# Altium schematic sheet TopAmplifier.SchDoc
size 215 x 228 mm; PageSetup: Record=PageOptions|CenterHorizontal=True|CenterVertical=True|PrintScale=0.97|XCorrection=1.00|YCorrection=1.00|PrintKind=1|BorderSize=5000000|LeftOffset=0|BottomOffset=0|Orientation=2|PaperLength=1270|PaperWidth=1000|Scale=100|PaperSource=4|PrintQuality=600|MediaType=1|DitherType=10|PaperKind=A4|PrintScaleMode=1
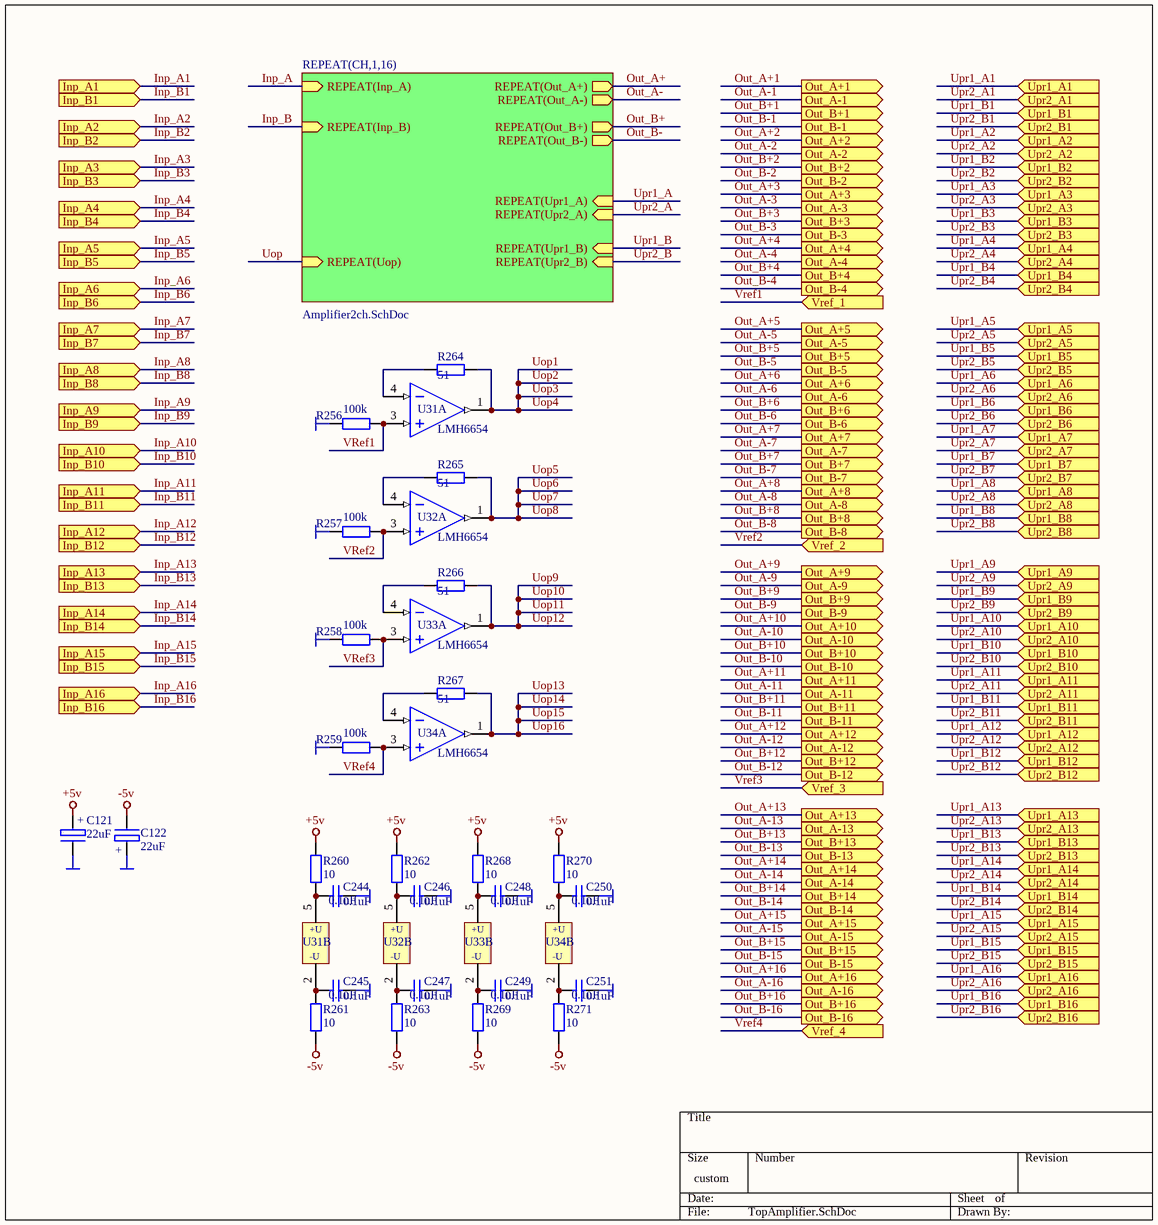
[diagram p0: TopAmplifier.SchDoc]

## Parts
C121  22uF  [CP6032]
C122  22uF  [CP6032]
C244  0.1uF  [0402]
C245  0.1uF  [0402]
C246  0.1uF  [0402]
C247  0.1uF  [0402]
C248  0.1uF  [0402]
C249  0.1uF  [0402]
C250  0.1uF  [0402]
C251  0.1uF  [0402]
R256  100k  [0603]
R257  100k  [0603]
R258  100k  [0603]
R259  100k  [0603]
R260  10  [0603]
R261  10  [0603]
R262  10  [0603]
R263  10  [0603]
R264  51  [0603]
R265  51  [0603]
R266  51  [0603]
R267  51  [0603]
R268  10  [0603]
R269  10  [0603]
R270  10  [0603]
R271  10  [0603]
U31  LMH6654  [SOT-23-5]  (parts A,B of 2)
U32  LMH6654  [SOT-23-5]  (parts A,B of 2)
U33  LMH6654  [SOT-23-5]  (parts A,B of 2)
U34  LMH6654  [SOT-23-5]  (parts A,B of 2)

## Sub-sheets
REPEAT(CH,1,16) = Amplifier2ch.SchDoc: REPEAT(Inp_A) (in), REPEAT(Out_A-) (out), REPEAT(Out_A+) (out), REPEAT(Out_B-) (out), REPEAT(Out_B+) (out), REPEAT(Inp_B) (in), REPEAT(Uop) (in), REPEAT(Upr1_A) (in), REPEAT(Upr2_A) (in), REPEAT(Upr1_B) (in), REPEAT(Upr2_B) (in)

## Ports
Inp_A1 (in), Inp_A2 (in), Inp_A3 (in), Inp_A4 (in), Inp_A5 (in), Inp_A6 (in), Inp_A7 (in), Inp_A8 (in), Inp_A9 (in), Inp_A10 (in), Inp_A11 (in), Inp_A12 (in), Inp_A13 (in), Inp_A14 (in), Inp_A15 (in), Inp_A16 (in), Inp_B1 (in), Inp_B2 (in), Inp_B3 (in), Inp_B4 (in), Inp_B5 (in), Inp_B6 (in), Inp_B7 (in), Inp_B8 (in), Inp_B9 (in), Inp_B10 (in), Inp_B11 (in), Inp_B12 (in), Inp_B13 (in), Inp_B14 (in), Inp_B15 (in), Inp_B16 (in), Out_A+1 (out), Out_A+2 (out), Out_A+3 (out), Out_A+4 (out), Out_A+5 (out), Out_A+6 (out), Out_A+7 (out), Out_A+8 (out), Out_A+9 (out), Out_A+10 (out), Out_A+11 (out), Out_A+12 (out), Out_A+13 (out), Out_A+14 (out), Out_A+15 (out), Out_A+16 (out), Out_A-1 (out), Out_A-2 (out), Out_A-3 (out), Out_A-4 (out), Out_A-5 (out), Out_A-6 (out), Out_A-7 (out), Out_A-8 (out), Out_A-9 (out), Out_A-10 (out), Out_A-11 (out), Out_A-12 (out), Out_A-13 (out), Out_A-14 (out), Out_A-15 (out), Out_A-16 (out), Out_B+1 (out), Out_B+2 (out), Out_B+3 (out), Out_B+4 (out), Out_B+5 (out), Out_B+6 (out), Out_B+7 (out), Out_B+8 (out), Out_B+9 (out), Out_B+10 (out), Out_B+11 (out), Out_B+12 (out), Out_B+13 (out), Out_B+14 (out), Out_B+15 (out), Out_B+16 (out), Out_B-1 (out), Out_B-2 (out), Out_B-3 (out), Out_B-4 (out), Out_B-5 (out), Out_B-6 (out), Out_B-7 (out), Out_B-8 (out), Out_B-9 (out), Out_B-10 (out), Out_B-11 (out), Out_B-12 (out), Out_B-13 (out), Out_B-14 (out), Out_B-15 (out), Out_B-16 (out), Upr1_A1 (in), Upr1_A2 (in), Upr1_A3 (in), Upr1_A4 (in), Upr1_A5 (in), Upr1_A6 (in), Upr1_A7 (in), Upr1_A8 (in), Upr1_A9 (in), Upr1_A10 (in), Upr1_A11 (in), Upr1_A12 (in), Upr1_A13 (in), Upr1_A14 (in), Upr1_A15 (in), Upr1_A16 (in), Upr1_B1 (in), Upr1_B2 (in), Upr1_B3 (in), Upr1_B4 (in), Upr1_B5 (in), Upr1_B6 (in), Upr1_B7 (in), Upr1_B8 (in), Upr1_B9 (in), Upr1_B10 (in), Upr1_B11 (in), Upr1_B12 (in), Upr1_B13 (in), Upr1_B14 (in), Upr1_B15 (in), Upr1_B16 (in), Upr2_A1 (in), Upr2_A2 (in), Upr2_A3 (in), Upr2_A4 (in), Upr2_A5 (in), Upr2_A6 (in), Upr2_A7 (in), Upr2_A8 (in), Upr2_A9 (in), Upr2_A10 (in), Upr2_A11 (in), Upr2_A12 (in), Upr2_A13 (in), Upr2_A14 (in), Upr2_A15 (in), Upr2_A16 (in), Upr2_B1 (in), Upr2_B2 (in), Upr2_B3 (in), Upr2_B4 (in), Upr2_B5 (in), Upr2_B6 (in), Upr2_B7 (in), Upr2_B8 (in), Upr2_B9 (in), Upr2_B10 (in), Upr2_B11 (in), Upr2_B12 (in), Upr2_B13 (in), Upr2_B14 (in), Upr2_B15 (in), Upr2_B16 (in), Vref_1 (in), Vref_2 (in), Vref_3 (in), Vref_4 (in)

## Nets
+5v: C121.+ R260.2 R262.2 R268.2 R270.2
-5v: C122.- R261.1 R263.1 R269.1 R271.1
AGND: C121.- C122.+ R256.1 R257.1 R258.1 R259.1
GND: C244.1 C245.1 C246.1 C247.1 C248.1 C249.1 C250.1 C251.1
Inp_A: sheet REPEAT(CH,1,16)/REPEAT(Inp_A)
Inp_A1: port Inp_A1
Inp_A2: port Inp_A2
Inp_A3: port Inp_A3
Inp_A4: port Inp_A4
Inp_A5: port Inp_A5
Inp_A6: port Inp_A6
Inp_A7: port Inp_A7
Inp_A8: port Inp_A8
Inp_A9: port Inp_A9
Inp_A10: port Inp_A10
Inp_A11: port Inp_A11
Inp_A12: port Inp_A12
Inp_A13: port Inp_A13
Inp_A14: port Inp_A14
Inp_A15: port Inp_A15
Inp_A16: port Inp_A16
Inp_B: sheet REPEAT(CH,1,16)/REPEAT(Inp_B)
Inp_B1: port Inp_B1
Inp_B2: port Inp_B2
Inp_B3: port Inp_B3
Inp_B4: port Inp_B4
Inp_B5: port Inp_B5
Inp_B6: port Inp_B6
Inp_B7: port Inp_B7
Inp_B8: port Inp_B8
Inp_B9: port Inp_B9
Inp_B10: port Inp_B10
Inp_B11: port Inp_B11
Inp_B12: port Inp_B12
Inp_B13: port Inp_B13
Inp_B14: port Inp_B14
Inp_B15: port Inp_B15
Inp_B16: port Inp_B16
Out_A+: sheet REPEAT(CH,1,16)/REPEAT(Out_A+)
Out_A+1: port Out_A+1
Out_A+2: port Out_A+2
Out_A+3: port Out_A+3
Out_A+4: port Out_A+4
Out_A+5: port Out_A+5
Out_A+6: port Out_A+6
Out_A+7: port Out_A+7
Out_A+8: port Out_A+8
Out_A+9: port Out_A+9
Out_A+10: port Out_A+10
Out_A+11: port Out_A+11
Out_A+12: port Out_A+12
Out_A+13: port Out_A+13
Out_A+14: port Out_A+14
Out_A+15: port Out_A+15
Out_A+16: port Out_A+16
Out_A-: sheet REPEAT(CH,1,16)/REPEAT(Out_A-)
Out_A-1: port Out_A-1
Out_A-2: port Out_A-2
Out_A-3: port Out_A-3
Out_A-4: port Out_A-4
Out_A-5: port Out_A-5
Out_A-6: port Out_A-6
Out_A-7: port Out_A-7
Out_A-8: port Out_A-8
Out_A-9: port Out_A-9
Out_A-10: port Out_A-10
Out_A-11: port Out_A-11
Out_A-12: port Out_A-12
Out_A-13: port Out_A-13
Out_A-14: port Out_A-14
Out_A-15: port Out_A-15
Out_A-16: port Out_A-16
Out_B+: sheet REPEAT(CH,1,16)/REPEAT(Out_B+)
Out_B+1: port Out_B+1
Out_B+2: port Out_B+2
Out_B+3: port Out_B+3
Out_B+4: port Out_B+4
Out_B+5: port Out_B+5
Out_B+6: port Out_B+6
Out_B+7: port Out_B+7
Out_B+8: port Out_B+8
Out_B+9: port Out_B+9
Out_B+10: port Out_B+10
Out_B+11: port Out_B+11
Out_B+12: port Out_B+12
Out_B+13: port Out_B+13
Out_B+14: port Out_B+14
Out_B+15: port Out_B+15
Out_B+16: port Out_B+16
Out_B-: sheet REPEAT(CH,1,16)/REPEAT(Out_B-)
Out_B-1: port Out_B-1
Out_B-2: port Out_B-2
Out_B-3: port Out_B-3
Out_B-4: port Out_B-4
Out_B-5: port Out_B-5
Out_B-6: port Out_B-6
Out_B-7: port Out_B-7
Out_B-8: port Out_B-8
Out_B-9: port Out_B-9
Out_B-10: port Out_B-10
Out_B-11: port Out_B-11
Out_B-12: port Out_B-12
Out_B-13: port Out_B-13
Out_B-14: port Out_B-14
Out_B-15: port Out_B-15
Out_B-16: port Out_B-16
Uop: sheet REPEAT(CH,1,16)/REPEAT(Uop)
Uop1: R264.2 U31.1(OUT)  [also labelled Uop2, Uop3, Uop4]
Uop5: R265.2 U32.1(OUT)  [also labelled Uop6, Uop7, Uop8]
Uop10: R266.2 U33.1(OUT)  [also labelled Uop11, Uop12, Uop9]
Uop13: R267.2 U34.1(OUT)  [also labelled Uop14, Uop15, Uop16]
Upr1_A: sheet REPEAT(CH,1,16)/REPEAT(Upr1_A)
Upr1_A1: port Upr1_A1
Upr1_A2: port Upr1_A2
Upr1_A3: port Upr1_A3
Upr1_A4: port Upr1_A4
Upr1_A5: port Upr1_A5
Upr1_A6: port Upr1_A6
Upr1_A7: port Upr1_A7
Upr1_A8: port Upr1_A8
Upr1_A9: port Upr1_A9
Upr1_A10: port Upr1_A10
Upr1_A11: port Upr1_A11
Upr1_A12: port Upr1_A12
Upr1_A13: port Upr1_A13
Upr1_A14: port Upr1_A14
Upr1_A15: port Upr1_A15
Upr1_A16: port Upr1_A16
Upr1_B: sheet REPEAT(CH,1,16)/REPEAT(Upr1_B)
Upr1_B1: port Upr1_B1
Upr1_B2: port Upr1_B2
Upr1_B3: port Upr1_B3
Upr1_B4: port Upr1_B4
Upr1_B5: port Upr1_B5
Upr1_B6: port Upr1_B6
Upr1_B7: port Upr1_B7
Upr1_B8: port Upr1_B8
Upr1_B9: port Upr1_B9
Upr1_B10: port Upr1_B10
Upr1_B11: port Upr1_B11
Upr1_B12: port Upr1_B12
Upr1_B13: port Upr1_B13
Upr1_B14: port Upr1_B14
Upr1_B15: port Upr1_B15
Upr1_B16: port Upr1_B16
Upr2_A: sheet REPEAT(CH,1,16)/REPEAT(Upr2_A)
Upr2_A1: port Upr2_A1
Upr2_A2: port Upr2_A2
Upr2_A3: port Upr2_A3
Upr2_A4: port Upr2_A4
Upr2_A5: port Upr2_A5
Upr2_A6: port Upr2_A6
Upr2_A7: port Upr2_A7
Upr2_A8: port Upr2_A8
Upr2_A9: port Upr2_A9
Upr2_A10: port Upr2_A10
Upr2_A11: port Upr2_A11
Upr2_A12: port Upr2_A12
Upr2_A13: port Upr2_A13
Upr2_A14: port Upr2_A14
Upr2_A15: port Upr2_A15
Upr2_A16: port Upr2_A16
Upr2_B: sheet REPEAT(CH,1,16)/REPEAT(Upr2_B)
Upr2_B1: port Upr2_B1
Upr2_B2: port Upr2_B2
Upr2_B3: port Upr2_B3
Upr2_B4: port Upr2_B4
Upr2_B5: port Upr2_B5
Upr2_B6: port Upr2_B6
Upr2_B7: port Upr2_B7
Upr2_B8: port Upr2_B8
Upr2_B9: port Upr2_B9
Upr2_B10: port Upr2_B10
Upr2_B11: port Upr2_B11
Upr2_B12: port Upr2_B12
Upr2_B13: port Upr2_B13
Upr2_B14: port Upr2_B14
Upr2_B15: port Upr2_B15
Upr2_B16: port Upr2_B16
Vref1: R256.2 U31.3(IN+) ; port Vref_1
Vref2: R257.2 U32.3(IN+) ; port Vref_2
Vref3: R258.2 U33.3(IN+) ; port Vref_3
Vref4: R259.2 U34.3(IN+) ; port Vref_4
NetC244_2: C244.2 R260.1 U31.5(VDD)
NetC245_2: C245.2 R261.2 U31.2(GND)
NetC246_2: C246.2 R262.1 U32.5(VDD)
NetC247_2: C247.2 R263.2 U32.2(GND)
NetC248_2: C248.2 R268.1 U33.5(VDD)
NetC249_2: C249.2 R269.2 U33.2(GND)
NetC250_2: C250.2 R270.1 U34.5(VDD)
NetC251_2: C251.2 R271.2 U34.2(GND)
NetR264_1: R264.1 U31.4(IN-)
NetR265_1: R265.1 U32.4(IN-)
NetR266_1: R266.1 U33.4(IN-)
NetR267_1: R267.1 U34.4(IN-)

## Notes on the sheet
- (in symbol LMH6654, part B) +U; -U

## Library data of the parts
C121 C122 = C POL
C244-C251 = Cap: Capacitor; Published: 8-Jun-2000; LatestRevisionDate: 17-Jul-2002; LatestRevisionNote: Re-released for DXP Platform.; PackageReference: RAD-0.3; Publisher: Altium Limited; Value: 0.1uF
R256-R271 = Res2: Resistor; Published: 8-Jun-2000; LatestRevisionDate: 17-Jul-2002; LatestRevisionNote: Re-released for DXP Platform.; PackageReference: AXIAL-0.4; Publisher: Altium Limited
  R256-R259: Value: 100k
  R260-R263 R268-R271: Value: 10
  R264-R267: Value: 51
U31-U34 = LMH6654: Value: LMH6654